# EAGLE schematic vco-test-both-sides (EAGLE 9.2.2)
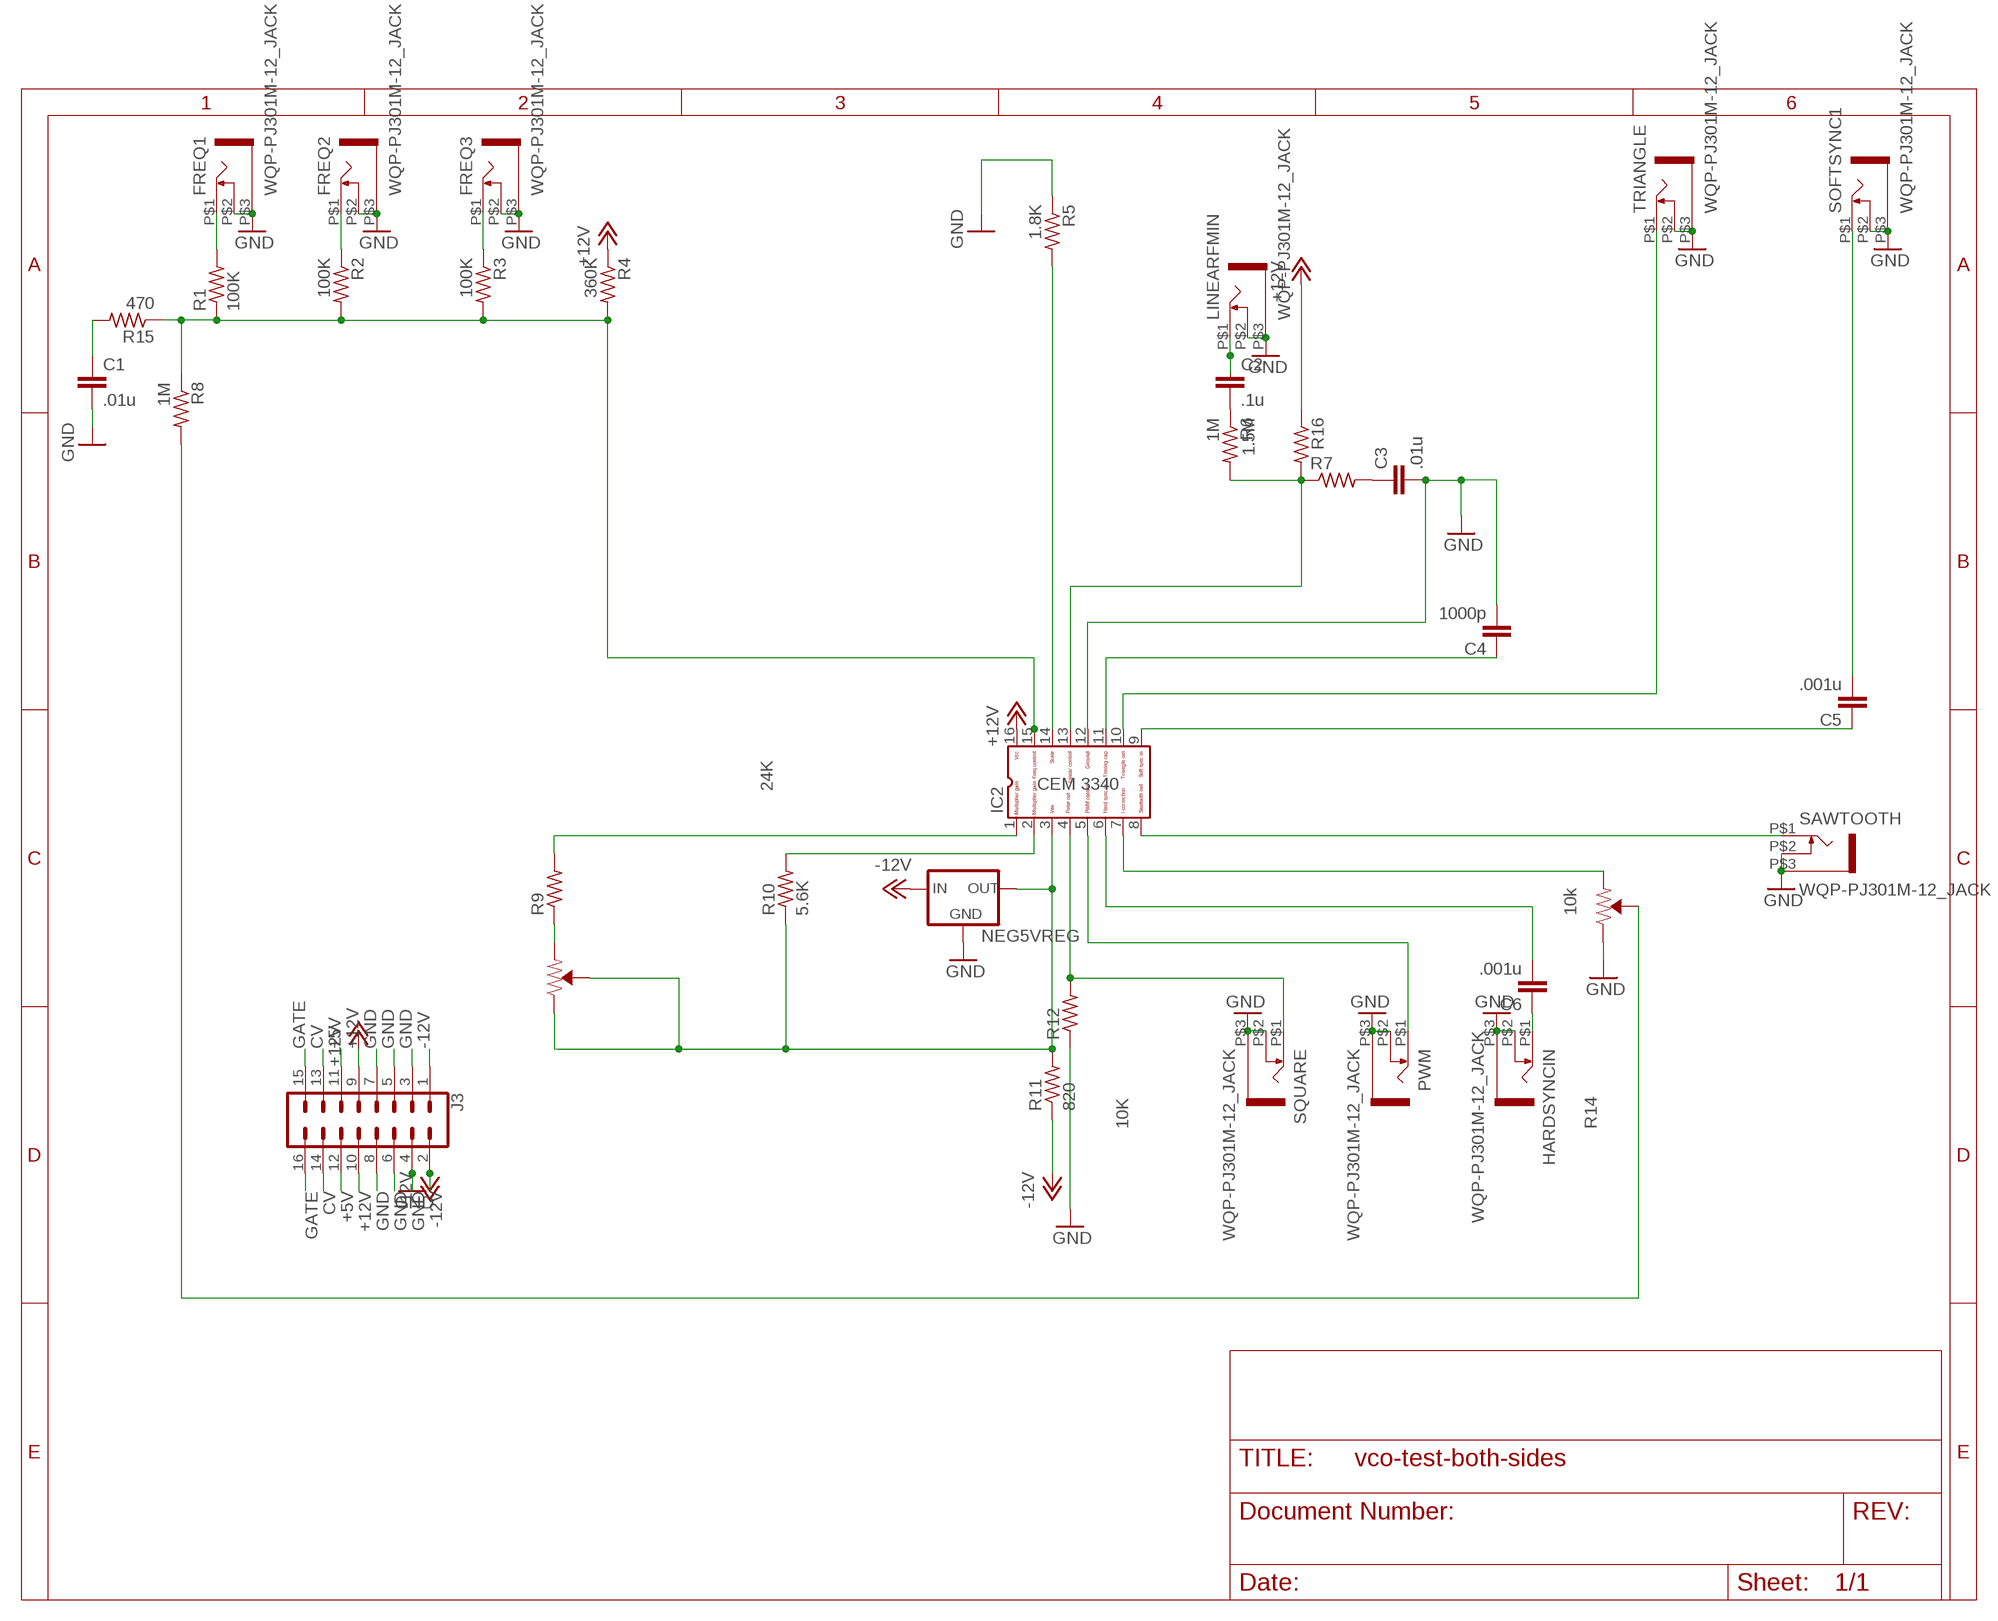
[diagram p0: schematic, sheet 1]

## Parts
C1  .01u  C-EU050-025X075  [C050-025X075]
C2  .1u  C-EU050-025X075  [C050-025X075]
C3  .01u  C-EU050-025X075  [C050-025X075]
C4  1000p  C-EU050-025X075  [C050-025X075]
C5  .001u  C-EU050-025X075  [C050-025X075]
C6  .001u  C-EU050-025X075  [C050-025X075]
FREQ1  WQP-PJ301M-12_JACK  [WQP-PJ301M-12_JACK]
FREQ2  WQP-PJ301M-12_JACK  [WQP-PJ301M-12_JACK]
FREQ3  WQP-PJ301M-12_JACK  [WQP-PJ301M-12_JACK]
HARDSYNCIN  WQP-PJ301M-12_JACK  [WQP-PJ301M-12_JACK]
IC2  CEM3340  [DIL16]
J3  CONN_08X2_SHROUD  [2X8-SHROUDED_LOCK]
LINEARFMIN  WQP-PJ301M-12_JACK  [WQP-PJ301M-12_JACK]
NEG5VREG  V_REG_78XXTO-92_UNTESTED  [TO-92]
PWM  WQP-PJ301M-12_JACK  [WQP-PJ301M-12_JACK]
R1  100K  R-US_0207/10  [0207/10]
R2  100K  R-US_0207/10  [0207/10]
R3  100K  R-US_0207/10  [0207/10]
R4  360K  R-US_0207/10  [0207/10]
R5  1.8K  R-US_0207/10  [0207/10]
R6  1M  R-US_0207/10  [0207/10]
R7  R-US_0207/10  [0207/10]
R8  1M  R-US_0207/10  [0207/10]
R9  24K  R-US_0207/10  [0207/10]
R10  5.6K  R-US_0207/10  [0207/10]
R11  820  R-US_0207/10  [0207/10]
R12  10K  R-US_0207/10  [0207/10]
R13  10k  TRIMPOT-PTH-10MM-KNOB-1/2W-10%  [TRIMPOT-PTH-3386U]
R14  10k  TRIMPOT-PTH-10MM-KNOB-1/2W-10%  [TRIMPOT-PTH-3386U]
R15  470  R-US_0207/10  [0207/10]
R16  1.5M  R-US_0207/10  [0207/10]
SAWTOOTH  WQP-PJ301M-12_JACK  [WQP-PJ301M-12_JACK]
SOFTSYNC1  WQP-PJ301M-12_JACK  [WQP-PJ301M-12_JACK]
SQUARE  WQP-PJ301M-12_JACK  [WQP-PJ301M-12_JACK]
TRIANGLE  WQP-PJ301M-12_JACK  [WQP-PJ301M-12_JACK]

## Nets
+5V: J3.11 J3.12
+12V: IC2.16 J3.9 J3.10 R4.1 R16.1
-12V: J3.1 J3.2 NEG5VREG.3(IN) R11.1
CV: J3.13 J3.14
GATE: J3.15 J3.16
GND: C3.2 C4.2 FREQ1.P$2 FREQ1.P$3 FREQ2.P$2 FREQ2.P$3 FREQ3.P$2 FREQ3.P$3 HARDSYNCIN.P$2 HARDSYNCIN.P$3 IC2.12 J3.3 J3.4 J3.5 J3.6 J3.7 J3.8 LINEARFMIN.P$2 LINEARFMIN.P$3 NEG5VREG.2(GND) PWM.P$2 PWM.P$3 R12.1 R14.3(CW) SAWTOOTH.P$2 SAWTOOTH.P$3 SOFTSYNC1.P$2 SOFTSYNC1.P$3 SQUARE.P$2 SQUARE.P$3 TRIANGLE.P$2 TRIANGLE.P$3
N$1: IC2.2 R10.2
N$2: C1.1 R15.2
N$3: IC2.14 R5.2
N$4: IC2.13 R6.2 R7.1 R16.2
N$5: C2.2 R6.1
N$6: C3.1 R7.2
N$7: C4.1 IC2.11
N$8: IC2.1 R9.2
N$9: C5.1 IC2.9
N$10: R8.2 R14.2(WIPER)
N$11: R9.1 R13.1(CCW)
N$12: IC2.3 NEG5VREG.1(OUT) R10.1 R11.2 R13.2(WIPER) R13.3(CW)
N$13: IC2.7 R14.1(CCW)
N$14: FREQ1.P$1 R1.2
N$15: C6.2 IC2.6
N$16: C6.1 HARDSYNCIN.P$1
N$18: IC2.4 R12.2 SQUARE.P$1
N$20: FREQ2.P$1 R2.1
N$21: IC2.15 R1.1 R2.2 R3.2 R4.2 R8.1 R15.1
N$22: FREQ3.P$1 R3.1
N$23: IC2.10 TRIANGLE.P$1
N$24: C2.1 LINEARFMIN.P$1
N$29: C5.2 SOFTSYNC1.P$1
N$31: IC2.8 SAWTOOTH.P$1
N$35: IC2.5 PWM.P$1
PE: C1.2 R5.1 ; supply symbol labelled GND

## Library data of the parts
C1-C6 = rcl:C-EU: CAPACITOR, European symbol; SPICEPREFIX: C
FREQ1 FREQ3 HARDSYNCIN LINEARFMIN PWM SAWTOOTH SOFTSYNC1 SQUARE TRIANGLE = thonkiconn:WQP-PJ301M-12_JACK
FREQ2 = thonkiconn:WQP-PJ301M-12_JACK; SPICEPREFIX: U
IC2 = CEM:CEM3340: CEM 3340 VCO
J3 = SparkFun-Connectors:CONN_08X2: Multi connection point. Often used as Generic Header-pin footprint for 0.1 inch spaced/style header connections You can populate with any combo of single row headers, but if you'd like an exact match, check this: Header - 2x8 (Male, 0.1") <https://www.sparkfun.com/products/13156> (PRT-13156) On any of the 0.1 inch spaced packages, you can populate with these: Break Away Headers - Straight <https://www.sparkfun.com/products/116> (PRT-00116) Break Away Male Headers - Right Angle <https://www.sparkfun.com/products/553> (PRT-00553) Female Headers <https://www.sparkfun.com/products/115> (PRT-00115) Break Away Headers - Machine Pin <https://www.sparkfun.com/products/117> (PRT-00117) Break Away Female Headers - Swiss Machine Pin <https://www.sparkfun.com/products/743> (PRT-00743)
NEG5VREG = SparkFun-IC-Power:V_REG_78XX: Voltage Regulator Standard 78xx regulator. IGO (Input Ground Output). Spark Fun Electronics SKU : COM-00107
R1-R12 R15 R16 = rcl:R-US_: RESISTOR, American symbol; SPICEPREFIX: R
R13 R14 = SparkFun-Resistors:TRIMPOT: Trimming Potentiometer (Trimpot) Three-terminal potentiometers, with an adjustable wiper and two adjustable resistors. A pot can be used to create a configurable voltage divider, or as a variable resistor. "Trimpots" are a subset of potentiometers, usually intended for "set-and-forget" applications. They're often more delicate than standard potentiometers - rated for fewer turns. Variants PTH-KNOB - PTH Trimpot w/ finger-adjustable knob Trimpot 10K with Knob <https://www.sparkfun.com/products/9806> (COM-09806) Datasheet <http://www.sparkfun.com/datasheets/Components/General/TSR-3386.pdf> SMD-3MM-CLOSED-FRAME - SMD 3mm Square Closed-Frame Trimpot Used on e.g. EasyDriver - Stepper Motor Driver <https://www.sparkfun.com/products/12779> Datasheet <http://www.bitechnologies.com/pdfs/22.pdf> (22AR10KTR) SMD-5MM - SMD 5mm Square Closed-Frame Trimpot Used on e.g. IOIO-OTG - V2.2 <https://www.sparkfun.com/products/13613> Datasheet <http://www.vishay.com/docs/51008/ts53.pdf> (TS53YL502MR10) SMD-3MM-1/10W-25% - 3mm Square Open-Frame Trimpot Used on e.g. SparkFun Shapeoko <https://www.sparkfun.com/products/13899> Datasheet <http://www.bourns.com/docs/Product-Datasheets/TC33.pdf> (TC33X-2-103E); PROD_ID: RES-09730; SF_SKU: COM-09806